# Altium project 26-TouchPad4P.PrjPcb
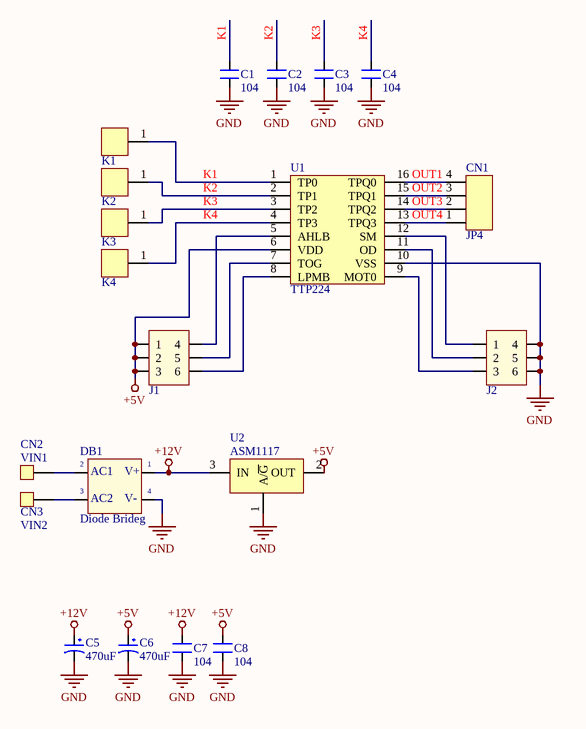
[diagram p0: 26-TouchPad4P.SchDoc]
1 sheet, 20 parts. Net scope: global (net labels, ports and power ports of the same name join across sheets).
Board file: 26-TouchPad4P.PcbDoc

## Sheet 26-TouchPad4P.SchDoc
size A

### Parts
C1  104  [C-0805]
C2  104  [C-0805]
C3  104  [C-0805]
C4  104  [C-0805]
C5  470uF  [C-ALU-D6.5]
C6  470uF  [C-ALU-D6.5]
C7  104  [C-0805]
C8  104  [C-0805]
CN1  JP4  [JP4]
CN2  VIN1  [M3]
CN3  VIN2  [M3]
DB1  Diode Brideg  [D-DB-1A-SMD]
J1  Connector 3x2  [JP3x2]  (value not drawn)
J2  Connector 3x2  [JP3x2]  (value not drawn)
K1  SWCP  [SWCP]  (value not drawn)
K2  SWCP  [SWCP]  (value not drawn)
K3  SWCP  [SWCP]  (value not drawn)
K4  SWCP  [SWCP]  (value not drawn)
U1  TTP224  [SSOP-20]
U2  ASM1117  [TO-252]

### Nets
+5V: C6.1 C8.2 J1.1 J1.2 J1.3 U1.6(VDD) U2.2(OUT)
+12V: C5.1 C7.2 DB1.3(AC2) U2.3(IN)
GND: C1.1 C2.1 C3.1 C4.1 C5.2 C6.2 C7.1 C8.1 DB1.4(-V_OUT) J2.4 J2.5 J2.6 U1.10(VSS) U2.1(A/~{G})
K1: C1.2 K1.1 U1.1(TP0)
K2: C2.2 K2.1 U1.2(TP1)
K3: C3.2 K3.1 U1.3(TP2)
K4: C4.2 K4.1 U1.4(TP3)
OUT1: CN1.4 U1.16(TPQ0)
OUT2: CN1.3 U1.15(TPQ1)
OUT3: CN1.2 U1.14(TPQ2)
OUT4: CN1.1 U1.13(TPQ3)
NetCN2_1: CN2.1 DB1.2(AC1)
NetCN3_1: CN3.1 DB1.1(+V_OUT)
NetJ1_4: J1.4 U1.5(AHLB)
NetJ1_5: J1.5 U1.7(TOG)
NetJ1_6: J1.6 U1.8(LPMB)
NetJ2_1: J2.1 U1.12(SM)
NetJ2_2: J2.2 U1.11(OD)
NetJ2_3: J2.3 U1.9(MOT0)

### Notes on the sheet
- (in symbol DB) V+; V-

### Library data of the parts
C1-C4 C7 C8 = CN: Value: 0,1uF/300V; Designed by: VanDungEvn
C5 C6 = CP1: Cap P  0,1uF < 22uF , 16 - 50V; Value: 10uF/50V; Description 1: 10 => 220uF/6,3V/10V - 10uF => 100uF/16V; Description 2: 0,1uF => 33uF/50V - 10uF => 22uF/63V; Description 3: 0,47uF => 10uF/100V
CN2 CN3 = COCDONGM3: Value: M3
DB1 = DB: Convert AC to DC voltage, 4 pin; Value: Cau 1A
J1 J2 = JP3x2: Value: Connector 3x2
U1 = TTP224: Value: TTP224